# EAGLE design tach_adapter (EAGLE 7.7.0)
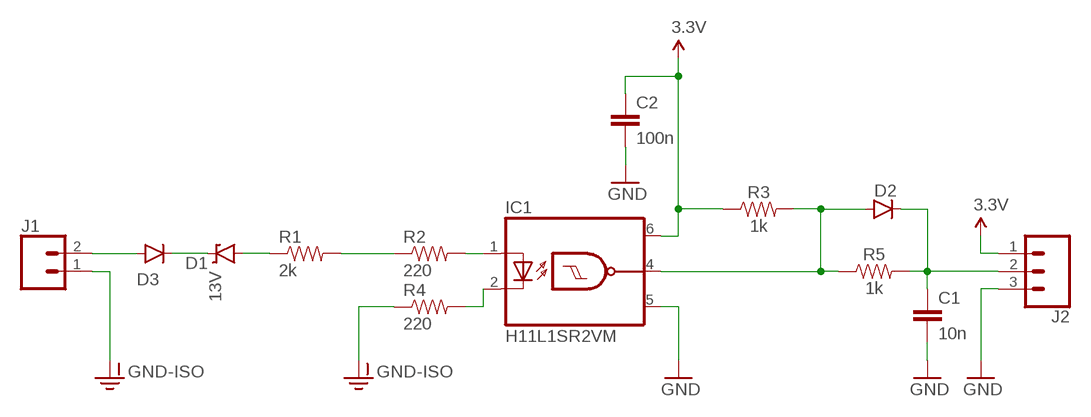
[diagram p0: schematic, sheet 1]

## Parts
C1  10n  CL10B103KB8NNNC  [0603]
C2  100n  CL10B104MB8NNNC  [0603]
D1  13V  DIODE-ZENERSMB  [SMB-DIODE]
D2  DIODESMA  [SMA-DIODE]
D3  DIODESMA  [SMA-DIODE]
IC1  H11L1SR2VM  [6-SMD]
J1  CONN_02LARGE  [1X02_LARGE]
J2  CONN_031X03_LARGE  [1X03_LARGE]
R1  2k  RESISTOR1206  [1206]
R2  220  RESISTOR1206  [1206]
R3  1k  RC0603JR-071KL  [0603]
R4  220  RESISTOR1206  [1206]
R5  1k  RC0603JR-071KL  [0603]

## Nets
3.3V: C2.1 IC1.6(VCC) J2.1 R3.1
GND: C1.2 C2.2 IC1.5(GND) J2.3
GND-ISO: J1.1 R4.1
N$1: D1.C D3.C
N$2: C1.1 D2.C J2.2 R5.2
N$3: D1.A R1.1
N$4: R1.2 R2.1
N$5: IC1.1(A) R2.2
N$6: IC1.2(C) R4.2
N$7: D2.A IC1.4(VOUT) R3.2 R5.1
N$8: D3.A J1.2

## Library data of the parts
C1 C2 = digital_dash:CL; VOLTAGE: 50V
D1 = SparkFun-DiscreteSemi:DIODE-ZENER: Zener Diode Production Part - 8199 3.4V Zener Voltage
D2 D3 = SparkFun-DiscreteSemi:DIODE: Diode These are standard reverse protection diodes and small signal diodes. SMA package can handle up to about 1A. SOD-323 can handle about 200mA. What the SOD-323 package when ordering, there are some mfgs out there that are 5-pin packages.
IC1 = tach_adapter:H11L1
J1 = digital_dash:CONN_02: Multi connection point. Often used as Generic Header-pin footprint for 0.1 inch spaced/style header connections On any of the 0.1 inch spaced packages, you can populate with these: Break Away Headers - Straight <https://www.sparkfun.com/products/116> (PRT-00116) Break Away Male Headers - Right Angle <https://www.sparkfun.com/products/553> (PRT-00553) Female Headers <https://www.sparkfun.com/products/115> (PRT-00115) Break Away Headers - Machine Pin <https://www.sparkfun.com/products/117> (PRT-00117) Break Away Female Headers - Swiss Machine Pin <https://www.sparkfun.com/products/743> (PRT-00743) For SCREWTERMINALS and SPRING TERMINALS visit here: Screw Terimnals on SparkFun.com <https://www.sparkfun.com/search/results?term=Screw+Terminals> (5mm/3.5mm/2.54mm spacing) This device is also useful as a general connection point to wire up your design to another part of your project. Our various solder wires solder well into these plated through hole pads. Hook-Up Wire - Assortment (Stranded, 22 AWG) <https://www.sparkfun.com/products/11375> (PRT-11375) Hook-Up Wire - Assortment (Solid Core, 22 AWG) <https://www.sparkfun.com/products/11367> (PRT-11367) View the entire wire category on our website here <https://www.sparkfun.com/categories/141> Special notes: Molex polarized connector foot print use with: PRT-08233 with associated crimp pins and housings. 2.54_SCREWTERM for use with PRT-10571. 3.5mm Screw Terminal footprints for PRT-08084 5mm Screw Terminal footprints for use with PRT-08432
J2 = digital_dash:CONN_03: Multi connection point. Often used as Generic Header-pin footprint for 0.1 inch spaced/style header connections On any of the 0.1 inch spaced packages, you can populate with these: Break Away Headers - Straight <https://www.sparkfun.com/products/116> (PRT-00116) Break Away Male Headers - Right Angle <https://www.sparkfun.com/products/553> (PRT-00553) Female Headers <https://www.sparkfun.com/products/115> (PRT-00115) Break Away Headers - Machine Pin <https://www.sparkfun.com/products/117> (PRT-00117) Break Away Female Headers - Swiss Machine Pin <https://www.sparkfun.com/products/743> (PRT-00743) Stackable Header - 3 Pin (Female, 0.1") <https://www.sparkfun.com/products/13875> (PRT-13875) For SCREWTERMINALS and SPRING TERMINALS visit here: Screw Terimnals on SparkFun.com <https://www.sparkfun.com/search/results?term=Screw+Terminals> (5mm/3.5mm/2.54mm spacing) This device is also useful as a general connection point to wire up your design to another part of your project. Our various solder wires solder well into these plated through hole pads. Hook-Up Wire - Assortment (Stranded, 22 AWG) <https://www.sparkfun.com/products/11375> (PRT-11375) Hook-Up Wire - Assortment (Solid Core, 22 AWG) <https://www.sparkfun.com/products/11367> (PRT-11367) View the entire wire category on our website here <https://www.sparkfun.com/categories/141> Special notes: Molex polarized connector foot print use with SKU : PRT-08232 with associated crimp pins and housings.
R1 R2 R4 = SparkFun-Passives:RESISTOR: Resistor Basic schematic elements and footprints for 0603, 1206, and PTH resistors.
R3 R5 = digital_dash:RC0603JR

## Board
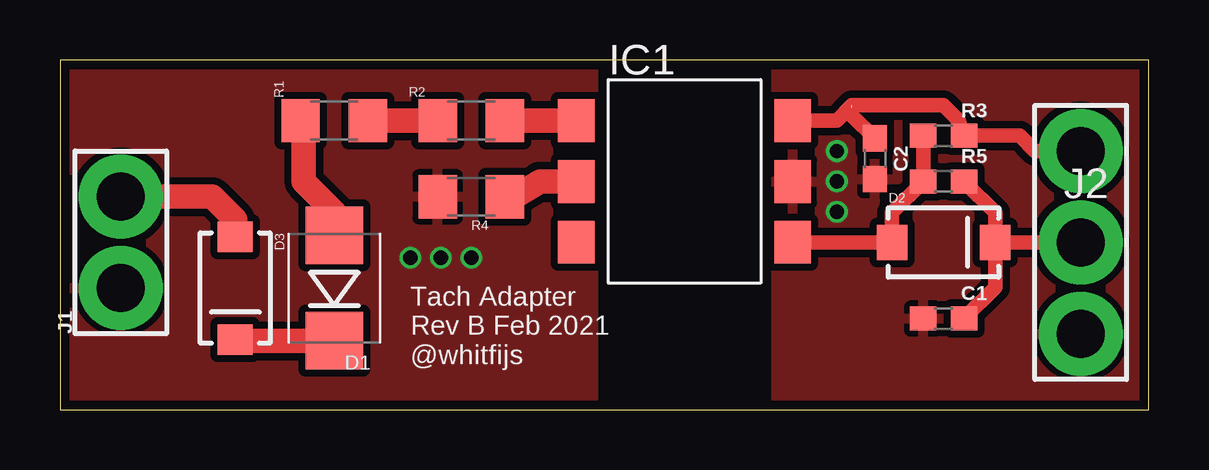
[diagram p1: board, top side]
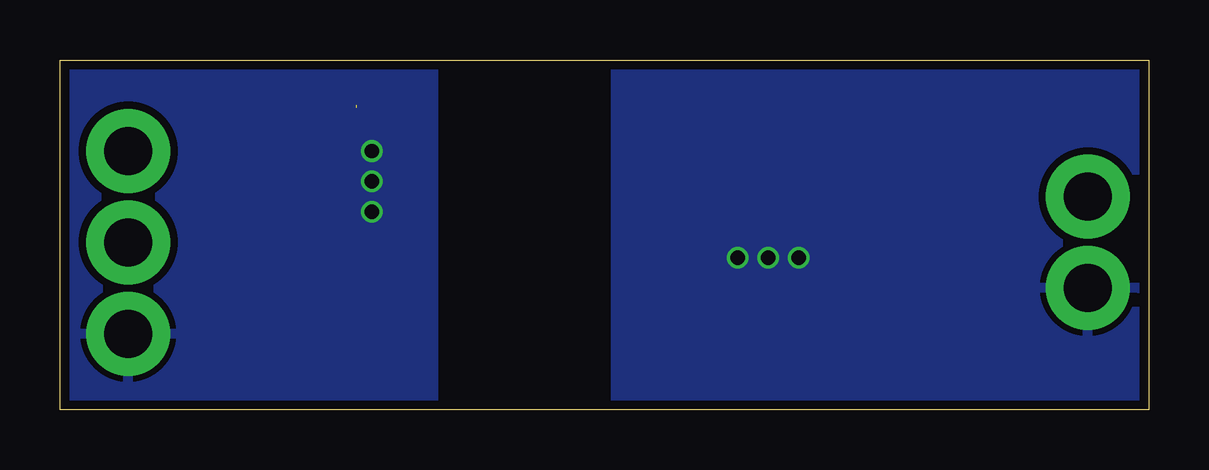
[diagram p2: board, bottom side, seen from below]

Size 45.39 x 14.59 mm. Coordinates in mm from the lower left corner, seen from the top.
Outline: 0,0 45.39,0 45.39,14.59 0,14.59 0,0
Copper layers (1*16): Top 0.035559375mm / dielectric 1.6mm / Bottom 0.035559375mm
Design rules "oshpark-2layer": minimum track width 6mil, minimum drill 10mil, track to track 6mil, track to pad 6mil, pad to pad 6mil, via to via 6mil, smd to smd 6mil, copper to edge 15mil, drill to drill 6mil, minimum pad ring 5mil, minimum via ring 5mil, stop-mask expansion 2.5mil, vias tented up to drill 0mil, thermal gap 10mil

### Footprints (pad centres in the part's own frame; a part is rotated, then mirrored left to right if it is on the bottom)
0603 = smd 1.1 x 1: 1 -0.85,0; 2 0.85,0
SMB-DIODE = smd 2.4 x 2.4: A 2.2,0; C -2.2,0
SMA-DIODE = smd 1.27 x 1.47: A -2.15,0; C 2.15,0
6-SMD = smd 1.525 x 1.78: 1 -4.508,2.54; 2 -4.508,0; 3 -4.508,-2.54; 4 4.508,-2.54; 5 4.508,0; 6 4.508,2.54
1X02_LARGE = drill 2 pad 3.5: 1 -2.54,0; 2 1.27,0
1X03_LARGE = drill 2 pad 3.5: 1 -3.81,0; 2 0,0; 3 3.81,0
1206 = smd 1.6 x 1.8: 1 -1.4,0; 2 1.4,0

### Placement (x,y rotation side)
C1  36.83,3.81 180 top
C2  33.97,10.48 270 top
D1  11.43,5.08 90 top
D2  36.83,6.98 0 top
D3  7.3,5.08 270 top
IC1  26.04,9.53 0 top
J1  2.54,7.62 90 top
J2  42.55,6.98 270 top
R1  11.43,12.06 0 top
R2  17.14,12.06 0 top
R3  36.83,11.43 180 top
R4  17.14,8.89 0 top
R5  36.83,9.53 0 top

### Tracks (layer width: path | path; a pad name or v marks a point on that pad's centre or on a via)
3.3V  (1 unrouted)
  Top 0.61: J2.1 40.64,10.79 40.01,11.43 R3.1 37.47,12.06 36.83,12.7 33.02,12.7 32.38,12.06 IC1.6 | 33.02,12.6 33.02,12.28 C2.1
GND  (via drill 0.6)
  other vias: 32.38,10.79 32.38,9.53 32.38,8.26
  pour Top (isolate 0.305): 29.84,14.61 29.84,0 45.09,0 45.09,14.61
  pour Bottom (isolate 0.305): 29.84,14.61 29.84,0 45.09,0 45.09,14.61
GND-ISO  (via drill 0.6)
  other vias: 14.61,6.35 15.88,6.35 17.14,6.35
  pour Top (isolate 0.305): 0,14.61 22.23,14.61 22.23,0 0,0
  pour Bottom (isolate 0.305): 0,14.61 22.23,14.61 22.23,0 0,0
N$1
  Top 1.016: D3.C 7.35,2.88 D1.C
N$2
  Top 0.61: C1.1 38.98,5.11 D2.C | R5.2 38.98,8.22 D2.C | J2.2 D2.C
N$3
  Top 1.016: R1.1 10.16,11.93 10.16,9.53 11.43,8.26 D1.A
N$4
  Top 1.016: R1.2 R2.1
N$5
  Top 1.016: IC1.1 R2.2
N$6
  Top 1.016: R4.2 19.18,9.02 20,9.53 IC1.2
N$7
  Top 0.61: R3.2 R5.1 34.68,8.22 D2.A IC1.4
N$8
  Top 1.016: J1.2 6.35,8.89 7.3,7.94 D3.A

### Text on the board
tNames: Tach Adapter / Rev B Feb 2021 / @whitfijs